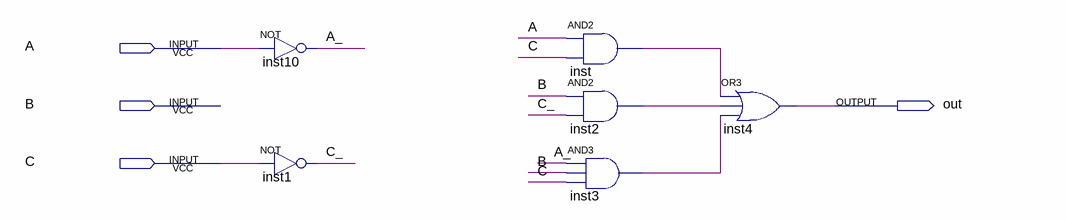
[diagram p0: schematic sheet]
// Quartus schematic Lab1_2.bdf as structural Verilog: 6 symbols, 4 pins
module Lab1_2 (
  input  A,
  input  B,
  input  C,
  output out
);

  wire A_, C_, inst2_out, inst3_out, inst_out;

  not inst10 (A_, A);
  not inst1 (C_, C);
  and inst (inst_out, A, C);
  and inst2 (inst2_out, B, C_);
  and inst3 (inst3_out, A_, B, C);
  or inst4 (out, inst_out, inst2_out, inst3_out);
endmodule
